# Altium schematic sheet BSPD v2.SchDoc: Brake System Plausibility Device
size 420 x 297 mm; Date: 25/05/23; DrawnBy: Georgios Papandreou; Revision: 2; CarNum: 105; Currentsheet: 1; Totalsheet: 1
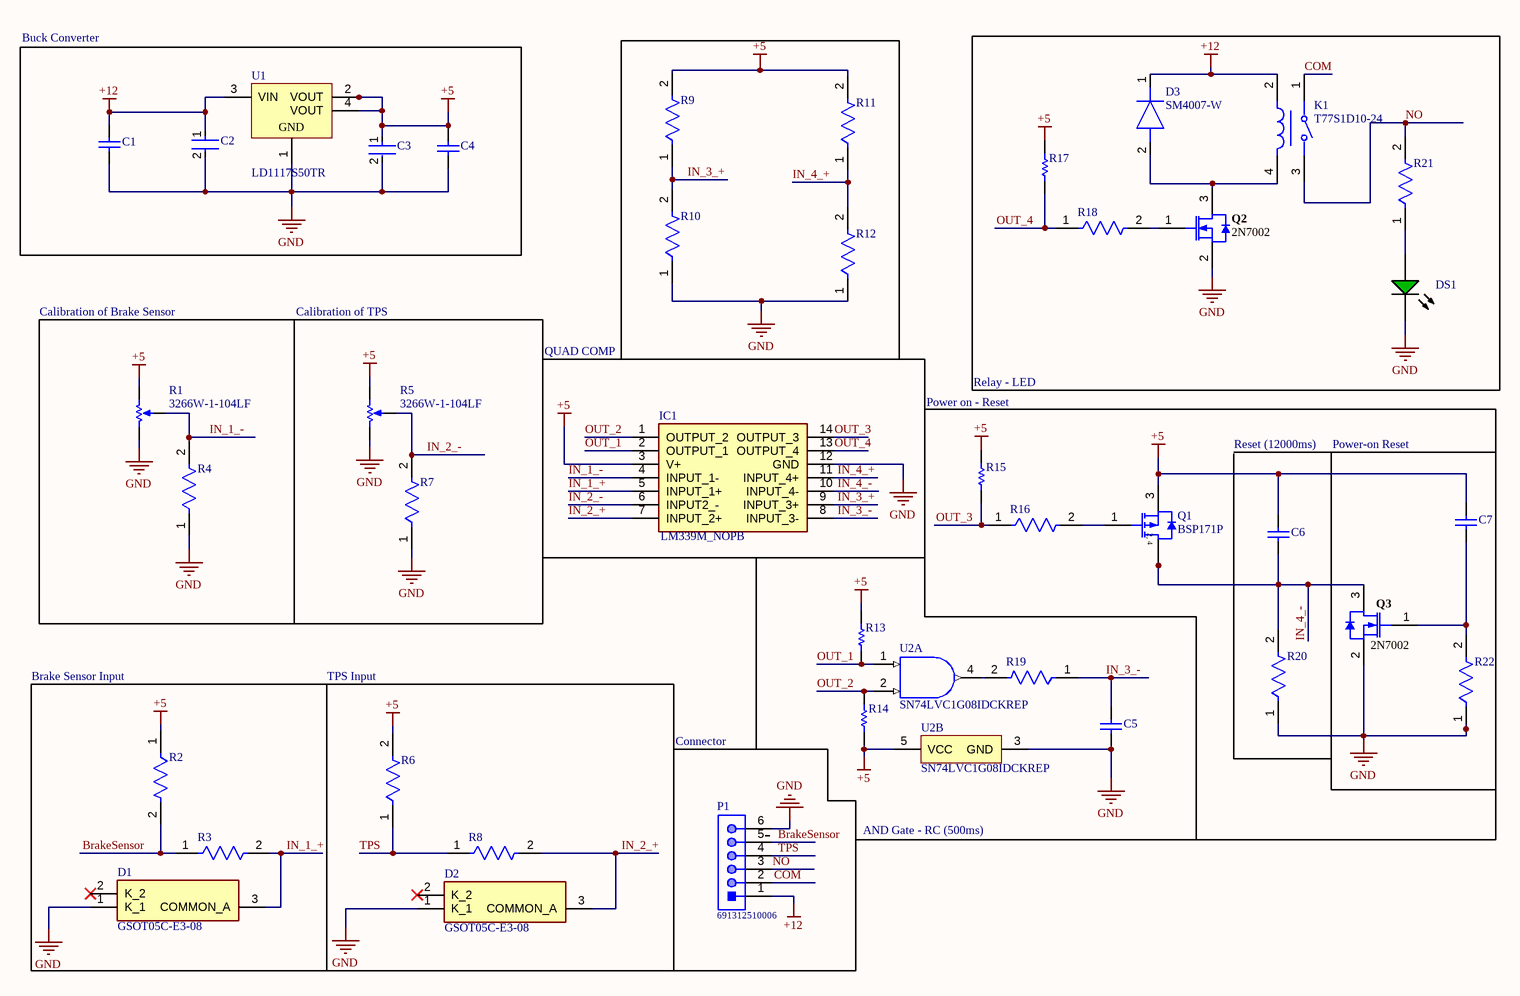
[diagram p0: BSPD v2.SchDoc]

## Parts
C1  C1206C106K8RACTU  [CAPC3216X180X50LL20T25]  (value not drawn)
C2  CL21B104KBCNNNC  [FP-CL21-IPC_C]  (value not drawn)
C3  CL21B104KBCNNNC  [FP-CL21-IPC_C]  (value not drawn)
C4  C1206C106K8RACTU  [CAPC3216X180X50LL20T25]  (value not drawn)
C5  C1206C106K8RACTU  [CAPC3216X180X50LL20T25]  (value not drawn)
C6  C1206C106K8RACTU  [CAPC3216X180X50LL20T25]  (value not drawn)
C7  C1206C106K8RACTU  [CAPC3216X180X50LL20T25]  (value not drawn)
D1  GSOT05C-E3-08  [SOT95P248X115-3N]
D2  GSOT05C-E3-08  [SOT95P248X115-3N]
D3  SM4007-W  [SM4007W]
DS1  LTST-C170KGKT  [LTST-LTST-C170KGKT-2_V]  (value not drawn)
IC1  LM339M_NOPB  [SOIC127P600X175-14N]
K1  T77S1D10-24  [FP-T77S1D10-24-MFG]
P1  691312510006  [691312510006]
Q1  BSP171P  [INF-PG-SOT223_SC-73_N]
Q2  2N7002  [INF-PG-SOT23_M]
Q3  2N7002  [INF-PG-SOT23_M]
R1  3266W-1-104LF  [BOUR-3266W-3_V]
R2  CRCW08052K00FKEA  [FP-CRCW0805-e3-IPC_B]  (value not drawn)
R3  CRCW08052K00FKEA  [FP-CRCW0805-e3-IPC_B]  (value not drawn)
R4  CRCW08052K00FKEA  [FP-CRCW0805-e3-IPC_B]  (value not drawn)
R5  3266W-1-104LF  [BOUR-3266W-3_V]
R6  CRCW08052K00FKEA  [FP-CRCW0805-e3-IPC_B]  (value not drawn)
R7  CRCW08052K00FKEA  [FP-CRCW0805-e3-IPC_B]  (value not drawn)
R8  CRCW08052K00FKEA  [FP-CRCW0805-e3-IPC_B]  (value not drawn)
R9  CRCW08052K00FKEA  [FP-CRCW0805-e3-IPC_B]  (value not drawn)
R10  CRCW08052K00FKEA  [FP-CRCW0805-e3-IPC_B]  (value not drawn)
R11  CRCW08052K00FKEA  [FP-CRCW0805-e3-IPC_B]  (value not drawn)
R12  CRCW08052K00FKEA  [FP-CRCW0805-e3-IPC_B]  (value not drawn)
R13  TNPW08053K00BEEA  [RESC2013X55X40NL15T20]  (value not drawn)
R14  TNPW08053K00BEEA  [RESC2013X55X40NL15T20]  (value not drawn)
R15  TNPW08053K00BEEA  [RESC2013X55X40NL15T20]  (value not drawn)
R16  CRCW08052K00FKEA  [FP-CRCW0805-e3-IPC_B]  (value not drawn)
R17  TNPW08053K00BEEA  [RESC2013X55X40NL15T20]  (value not drawn)
R18  CRCW08052K00FKEA  [FP-CRCW0805-e3-IPC_B]  (value not drawn)
R19  CRCW08052K00FKEA  [FP-CRCW0805-e3-IPC_B]  (value not drawn)
R20  CR0805-JW-125ELF  [FP-CR0805-IPC_A]  (value not drawn)
R21  CRCW08052K00FKEA  [FP-CRCW0805-e3-IPC_B]  (value not drawn)
R22  CRCW08052K00FKEA  [FP-CRCW0805-e3-IPC_B]  (value not drawn)
U1  LD1117S50TR  [SOT-223_L]
U2  SN74LVC1G08IDCKREP  [DCK0005A_L]  (parts A,B of 2)

## Blocks framed on the sheet
Buck Converter: C1-C4 U1
Relay - LED: D3 DS1 K1 Q2 R17 R18 R21
Calibration of Brake Sensor: R1 R4
Reset (12000ms): C6 R20

## Nets
+5: C3.1 C4.2 C6.2 C7.2 IC1.3(V+) Q1.3(SOURCE) R1.1(CCW) R2.1 R5.1(CCW) R6.2 R9.2 R11.2 R13.2 R14.2 R15.2 R17.2 U1.2(VOUT) U1.4(VOUT) U2.5(VCC)
+12: C1.2 C2.1 D3.1(K) K1.2 P1.1 U1.3(VIN)
GND: C1.1 C2.2 C3.2 C4.1 C5.1 D1.1(K_1) D2.1(K_1) DS1.1(K) IC1.12(GND) P1.6 Q2.2(SOURCE) Q3.2(SOURCE) R1.3(CW) R4.1 R5.3(CW) R7.1 R10.1 R12.1 R20.1 R22.1 U1.1(GND) U2.3(GND)
BrakeSensor: P1.5 R2.2 R3.1
COM: K1.1 P1.2
IN_1_+: D1.3(COMMON_A) IC1.5(INPUT_1+) R3.2
IN_1_-: IC1.4(INPUT_1-) R1.2(WIPER) R4.2
IN_2_+: D2.3(COMMON_A) IC1.7(INPUT_2+) R8.2
IN_2_-: IC1.6(INPUT2_-) R5.2(WIPER) R7.2
IN_3_+: IC1.9(INPUT_3+) R9.1 R10.2
IN_3_-: C5.2 IC1.8(INPUT_3-) R19.1
IN_4_+: IC1.11(INPUT_4+) R11.1 R12.2
IN_4_-: C6.1 IC1.10(INPUT_4-) Q1.2(DRAIN) Q1.4(DRAIN) Q3.3(DRAIN) R20.2
NO: K1.3 P1.3 R21.2
OUT_1: IC1.2(OUTPUT_1) R13.1 U2.1(A)
OUT_2: IC1.1(OUTPUT_2) R14.1 U2.2(B)
OUT_3: IC1.14(OUTPUT_3) R15.1 R16.1
OUT_4: IC1.13(OUTPUT_4) R17.1 R18.1
TPS: P1.4 R6.1 R8.1
NetC7_1: C7.1 Q3.1(GATE) R22.2
NetD3_2: D3.2(A) K1.4 Q2.3(DRAIN)
NetDS1_2: DS1.2(A) R21.1
NetQ1_1: Q1.1(GATE) R16.2
NetQ2_1: Q2.1(GATE) R18.2
NetR19_2: R19.2 U2.4(Y)

Not connected (* = marked no-connect by the designer): D1 2(K_2)*; D2 2(K_2)*

## Notes on the sheet
- Calibration of TPS
- QUAD COMP
- (near R15) Power on - Reset
- Power-on Reset
- Brake Sensor Input
- TPS Input
- Connector
- AND Gate - RC (500ms)
- TITLE
- DATE
- DRAWN BY
- CAR NUMBER
- SIZE
- REV
- SHEET
- A3
- /
- (in symbol CMP-1099-00025-1) 2, 4

## Library data of the parts
C1 C4-C6 = CMP-2000-06013-1: Chip Capacitor, 10 uF, +/- 10%, 10 V, -55 to 125 degC, 1206 (3216 Metric), RoHS, Tape and Reel; Type: SMDMLCCX7R6.3-250VDCCommericalGrade; Class: Class1; Case Height: 1.6mm; Temperature Coefficient / Code: +/-15%; Capacitance: 10uF; Brand: Kemet; Case Length: 3.2mm; Dissipation Factor DF: 5; Voltage Rating: 10V; Dielectric: X7R; Tolerance: 10%; Package Reference: 1206; Dimensions: 1.6mmWx3.2mmLx1.6mmH; Series: C1206C; Minimum Operating Temperature: -55C; RoHS: Details; Termination Style: SMD/SMT; Mounting Technology: SurfaceMount; Manufacturer: Kemet; Product Category: MultilayerCeramicCapacitorsMLCC-SMD/SMT; Case Code - mm: 3216; Manufacturer URL: http://www.kemet.com/; Product: GeneralTypeMLCCs; Package Description: 2-Pin Surface Mount Device, Body 3.2 x 1.6 mm; Case Width: 1.6mm; Factory Pack Quantity: 2000; Package / Case: 1206(3216metric); Datasheet URL: http://www.kemet.com/docfinder?Partnumber=C1206C106K8RACTU; Datasheet Version: 02/2016; Operating Temperature Range: -55Cto+125C; Voltage Rating DC: 10V; Case Code - in: 1206; Maximum Operating Temperature: +125C; Packaging: Reel
C2 C3 = CMP-2000-05017-2: CL21 Series 0805 100nF 50V ±10% Tolerance X7R Multilayer Ceramic Chip Capacitor; Depth: 1.25mm; Height: 0.85mm; Width: 0.049inch; Tolerance: 10%; Case Code (Metric): 2012; Case Code (Imperial): 0805; Material: Ceramic; Thickness: 0.037inch; Min Operating Temperature: -55°C; Contact Plating: Tin; Length: 2mm; Mount: Surface Mount; Voltage Rating (DC): 50V; Lead Free: Lead Free; Dielectric: X7R; Radiation Hardening: No; Capacitance: 100nF; Voltage Rating: 50V; Case/Package: 0805; Packaging: Tape and Reel; Max Operating Temperature: 125°C; Voltage: 50V
C7 = CMP-2000-06013-1: Chip Capacitor, 100 nF, +/- 10%, 10 V, -55 to 125 degC, 1206 (3216 Metric), RoHS, Tape and Reel; Type: SMDMLCCX7R6.3-250VDCCommericalGrade; Class: Class1; Case Height: 1.6mm; Temperature Coefficient / Code: +/-15%; Capacitance: 10uF; Brand: Kemet; Case Length: 3.2mm; Dissipation Factor DF: 5; Voltage Rating: 10V; Dielectric: X7R; Tolerance: 10%; Package Reference: 1206; Dimensions: 1.6mmWx3.2mmLx1.6mmH; Series: C1206C; Minimum Operating Temperature: -55C; RoHS: Details; Termination Style: SMD/SMT; Mounting Technology: SurfaceMount; Manufacturer: Kemet; Product Category: MultilayerCeramicCapacitorsMLCC-SMD/SMT; Case Code - mm: 3216; Manufacturer URL: http://www.kemet.com/; Product: GeneralTypeMLCCs; Package Description: 2-Pin Surface Mount Device, Body 3.2 x 1.6 mm; Case Width: 1.6mm; Factory Pack Quantity: 2000; Package / Case: 1206(3216metric); Datasheet URL: http://www.kemet.com/docfinder?Partnumber=C1206C106K8RACTU; Datasheet Version: 02/2016; Operating Temperature Range: -55Cto+125C; Voltage Rating DC: 10V; Case Code - in: 1206; Maximum Operating Temperature: +125C; Packaging: Reel
D1 D2 = GSOT05C-E3-08: Diode ESD (Uni-directional); Manufacturer_Name: Vishay; Datasheet Link: http://www.vishay.com/docs/85824/gsot03c.pdf; Height: 1.15mm; Manufacturer_Part_Number: GSOT05C-E3-08; Mouser Part Number: 78-GSOT05C-E3-08; Mouser Price/Stock: https://www.mouser.co.uk/ProductDetail/Vishay-Semiconductors/GSOT05C-E3-08?qs=S660mHfF5o3O8BVbua%252BuVg%3D%3D; Arrow Part Number: GSOT05C-E3-08; Arrow Price/Stock: https://www.arrow.com/en/products/gsot05c-e3-08/vishay?region=nac
D3 = SM4007-W: Diode; Manufacturer_Name: Rectron; Datasheet Link: https://componentsearchengine.com/Datasheets/1/SM4007-W.pdf; Manufacturer_Part_Number: SM4007-W; Mouser Part Number: 583-SM4007; Mouser Price/Stock: https://www.mouser.co.uk/ProductDetail/Rectron/SM4007-W?qs=Eu63EZxBwKLdRxdF7bUaug%3D%3D; Arrow Part Number: SM4007-W; Arrow Price/Stock: https://www.arrow.com/en/products/sm4007-w/rectron?region=nac
DS1 = CMP-2000-06620-1: Ultra Bright AlInGaP Chip LED, 75 mW, -55 to 85 degC, 2-Pin SMD (0805), RoHS, Tape and Reel; Manufacturer: Lite-On; Forward Current: 30mA; Power Dissipation Max: 75mW; Emitting Color: YellowGreen; Type: Uni-Color; Forward Voltage: 2.4V; Dominant Wave Length: 571nm; Test Current (It): 20mA; Product Length (mm): 2mm; Peak Wavelength: 574nm; Power Dissipation: 75W; Product Depth (mm): 1.25mm; DELETED: Compliant; High Brightness: Yes; Product Height (mm): 1.1mm; Luminous Intensity: 35mcd; Shape Type: Rectangular; Chip Material: AlGaInP; Viewing Angle: 130deg; Number of  Elements: 1; Reverse Voltage: 5V; Rad Hardened: No; Package Type: ChipLed; Manufacturer URL: http://www.us.liteon.com/; Mounting: SurfaceMount; Operating Temp Range: -55Cto85C; Datasheet URL: http://optoelectronics.liteon.com/upload/download/DS22-2000-073/S_110_LTST-C170KGKT.pdf; Packaging: TapeandReel; Pin Count: 2; Package Description: 2-Pin Surface Mounted Device, Body 2 x 1.25 mm; Mounting Technology: SurfaceMount; Package Reference: LTST-C170KGKT-2; Forward Current Max: 30mA; Datasheet Version: Rev. G, 06/2005; Lens Dimensions: 1.4x1.25x0.6mm; Operating Temperature Classification: Industrial; Lum Intensity: 35mcd; Main Category: ChipLED
IC1 = LM339M_NOPB: Integrated Circuit; Manufacturer_Name: Texas Instruments; Manufacturer_Part_Number: LM339M/NOPB; Datasheet Link: https://www.ti.com/general/docs/suppproductinfo.tsp?distId=10&gotoUrl=http%3A%2F%2Fwww.ti.com%2Flit%2Fgpn%2Flm139-n; Height: 1.75mm; Mouser Part Number: 926-LM339M/NOPB; Mouser Price/Stock: https://www.mouser.co.uk/ProductDetail/Texas-Instruments/LM339M-NOPB?qs=X1J7HmVL2ZHXeViUFGsFqA%3D%3D; Arrow Part Number: LM339M/NOPB; Arrow Price/Stock: https://www.arrow.com/en/products/lm339mnopb/texas-instruments
K1 = CMP-03395-000209-1: RELAY GEN PURPOSE SPST 10A 24V; Max Voltage Rating (DC): 30V; Relay Type: General Purpose; Max Voltage Rating (AC): 250V; Coil Power: 500mW; Coil Current: 18.75mA; Operate Time: 10ms; Release Time: 4ms; Approvals: UL; Coil Resistance: 1.28kR; Coil Type: Non-Latching; Mount: Through Hole; RoHS Compliant: Yes; Height: 14.7mm; Current Rating: 10A; Throw Configuration: SPST; Package Quantity: 100; Application(s): GENERAL PURPOSE; Voltage Rating (AC): 250V; Depth: 10.2mm; Min Operating Temperature: -30°C; Length: 0.717inch; Max Operating Temperature: 85°C; Width: 0.4inch; Contact Material: Silver; Packaging: Tray; Termination: PCB; Contact Current Rating: 10A; Number of Pins: 4; Coil Voltage (DC): 24V; Weight: 9g; Series: T77; Radiation Hardening: No; Contact Voltage Rating (DC): 30V
P1 = CMP-1502-02173-1: Serie 312 - 5.08mm Open Horizontal PCB Header WR-TBL, 6 pin; Manufacturer: Wurth Elektronik; Pin Number: 6; Gender: Male; Pitch: 5.08mm; Mounting Technology: THT; Manufacturer URL: http://www.we-online.de; Package Reference: 691312510006; Publisher: WurthElektronik; Packaging: Box; Operating Temperature: -40to105degC; Datasheet URL: http://katalog.we-online.de/em/datasheet/6913125100xx.pdf; Part Number: 691312510006
Q1 = CMP-1099-00025-1: P-Channel SIPMOS Small-Signal-Transistor, -60 V VDS, -1.9 A ID, -55 to 150 degC, PG-SOT223 (SC-73), Reel, Green; Manufacturer: Infineon; Polarity: P; QG: -13Â nC; VGS(th) (min): -1Â V; ID (max): -1.9Â A; RDS (on) (max): 300Â mOhm; VDS (max): -60Â V; Pto t (max): 1.8Â W; VGS(th) (max): -2Â V; Mode: Enhancement; Rth: 110Â K/W; IDpuls (max): -7.6Â A; Green: TRUE; Packing: Reel; DatasheetVersion: Rev. 2.7; ComponentLink3URL: http://www.infineon.com/dgdl/SOT223-Package_Overview.pdf?folderId=db3a30431936bc4b0119530470b03c3d&fileId=db3a30431936bc4b0119531d40b93c5c; Mounting Technology: Surface Mount; Halogen-free: TRUE; PackageVersion: Apr-08; ComponentLink2URL: http://www.infineon.com/dgdl/BSP171P_Rev2.7.pdf?folderId=db3a304314dca38901154a72e3951a65&fileId=db3a30433b47825b013b6004f59a57fa; PackageReference: PG-SOT223 (SC-73); ComponentLink3Description: Package Specification; PackageDescription: 4-Pin Small Outline Transistor Package, 6.5 x 3.5 mm Body, 2.3 mm Pitch; ComponentLink1Description: Manufacturer URL; Technology: SIPMOS; PartNumber: BSP171P; ComponentLink1URL: http://www.infineon.com/; ComponentLink2Description: Datasheet
Q2 Q3 = CMP-1149-00026-1: N-Channel OptiMOS Small-Signal-Transistor, 60 V VDS, 0.3 A ID, -55 to 150 degC, PG-SOT23, Reel, Green; Manufacturer: Infineon; RDS (on) (max) (@4.5V): 4,000 mOhm; VDS (max): 60 V; IDpuls (max): 1.2Â A; QG: 0.4Â nC; RDS (on) (max): 3,000 mOhm; RthJA (max): 250 K/W; ID (max): 0.3Â A; VGS(th) (max): 2.5Â V; VGS(th) (min): 1.5Â V; Green: TRUE; Ptot (max): 0.5Â W; PackageDescription: 3-Pin Small Outline Transistor Package, 2.9 x 1.3 mm Body, 0.95 mm Pitch; Halogen-free: TRUE; ComponentLink2Description: Datasheet; ComponentLink1URL: http://www.infineon.com/; Packing: Reel; DatasheetVersion: Rev. 2.4; PartNumber: 2N7002; PackageReference: PG-SOT23; PackageVersion: Apr-08; ComponentLink3URL: http://www.infineon.com/dgdl/SOT23-Package_Overview.pdf?folderId=db3a30431936bc4b0119532290053c66&fileId=db3a30431936bc4b0119533468123c85; ComponentLink1Description: Manufacturer URL; Mounting Technology: Surface Mount; ComponentLink3Description: Package Specification; ComponentLink2URL: http://www.infineon.com/dgdl/2N7002_Rev2.4.pdf?folderId=db3a3043156fd573011622e10b5c1f67&fileId=db3a304319bc939a0119c2a9461e79e6
R1 R5 = CMP-0975-00021-1: Square Trimpot Trimming Potentiometer, 100 KOhm, 0.25 W, -55 to 125 degC, 3-Pin THD, RoHS, Tube; Manufacturer: Bourns; Power Rating@70 degC: 0.25 W; Tolerance: +/-10%; ComponentLink2URL: https://www.bourns.com/data/global/pdfs/3266.pdf; ComponentLink3Description: Package Specification; ComponentLink1URL: https://www.bourns.com/; ComponentLink2Description: Datasheet; DatasheetVersion: Apr-14; ComponentLink3URL: https://www.bourns.com/data/global/pdfs/3266.pdf; Mounting Technology: Through Hole; Packing: Tube; PackageDescription: 3-Pin THD, Body 6.35 x 4.31 mm, Pitch 2.54 mm; ComponentLink1Description: Manufacturer URL; Operating Temperature: -55 to 125 degC; PartNumber: 3266W-1-104LF; Resistance: 100 kOhm; RoHS: TRUE
R2 R6 R10 = CMP-2001-03755-2: RES Thick Film, 100kΩ, 1%, 0.125W, 100ppm/°C, 0805; Working Voltage: 150V; Max Power Dissipation: 125mW; Resistance: 2kR; Package Quantity: 10; Case Code (Metric): 2012; Voltage Rating: 150V; Number of Terminations: 2; Max Operating Temperature: 155°C; Depth: 1.25mm; Tolerance: 1%; Power Rating: 125mW; Lead Free: Lead Free; Case/Package: 0805; Features: Automotive AEC-Q200; Min Operating Temperature: -55°C; Termination: SMD/SMT; Case Code (Imperial): 0805; Weight: 0.000194oz; Packaging: Tape and Reel; Military Standard: Not; Radiation Hardening: No; Contact Plating: Tin; Mount: Surface Mount; Temperature Coefficient: 100ppm/°C; Height: 0.02inch; Number of Terminals: 2; Voltage Rating (DC): 150V; Number of Pins: 2; Length: 2mm; Width: 1.25mm; Composition: Thick Film
R3 R4 R7 R8 R12 = CMP-2001-03755-2: RES Thick Film, 10kΩ, 1%, 0.125W, 100ppm/°C, 0805; Working Voltage: 150V; Max Power Dissipation: 125mW; Resistance: 2kR; Package Quantity: 10; Case Code (Metric): 2012; Voltage Rating: 150V; Number of Terminations: 2; Max Operating Temperature: 155°C; Depth: 1.25mm; Tolerance: 1%; Power Rating: 125mW; Lead Free: Lead Free; Case/Package: 0805; Features: Automotive AEC-Q200; Min Operating Temperature: -55°C; Termination: SMD/SMT; Case Code (Imperial): 0805; Weight: 0.000194oz; Packaging: Tape and Reel; Military Standard: Not; Radiation Hardening: No; Contact Plating: Tin; Mount: Surface Mount; Temperature Coefficient: 100ppm/°C; Height: 0.02inch; Number of Terminals: 2; Voltage Rating (DC): 150V; Number of Pins: 2; Length: 2mm; Width: 1.25mm; Composition: Thick Film
R9 R11 R19 = CMP-2001-03755-2: RES Thick Film, 39kΩ, 1%, 0.125W, 100ppm/°C, 0805; Working Voltage: 150V; Max Power Dissipation: 125mW; Resistance: 2kR; Package Quantity: 10; Case Code (Metric): 2012; Voltage Rating: 150V; Number of Terminations: 2; Max Operating Temperature: 155°C; Depth: 1.25mm; Tolerance: 1%; Power Rating: 125mW; Lead Free: Lead Free; Case/Package: 0805; Features: Automotive AEC-Q200; Min Operating Temperature: -55°C; Termination: SMD/SMT; Case Code (Imperial): 0805; Weight: 0.000194oz; Packaging: Tape and Reel; Military Standard: Not; Radiation Hardening: No; Contact Plating: Tin; Mount: Surface Mount; Temperature Coefficient: 100ppm/°C; Height: 0.02inch; Number of Terminals: 2; Voltage Rating (DC): 150V; Number of Pins: 2; Length: 2mm; Width: 1.25mm; Composition: Thick Film
R13-R15 R17 = CMP-2001-04767-1: Manufacturer: Vishay Dale; Part Number: TNPW08053K00BEEA
R16 R18 = CMP-2001-03755-2: RES Thick Film, 100Ω, 1%, 0.125W, 100ppm/°C, 0805; Working Voltage: 150V; Max Power Dissipation: 125mW; Resistance: 2kR; Package Quantity: 10; Case Code (Metric): 2012; Voltage Rating: 150V; Number of Terminations: 2; Max Operating Temperature: 155°C; Depth: 1.25mm; Tolerance: 1%; Power Rating: 125mW; Lead Free: Lead Free; Case/Package: 0805; Features: Automotive AEC-Q200; Min Operating Temperature: -55°C; Termination: SMD/SMT; Case Code (Imperial): 0805; Weight: 0.000194oz; Packaging: Tape and Reel; Military Standard: Not; Radiation Hardening: No; Contact Plating: Tin; Mount: Surface Mount; Temperature Coefficient: 100ppm/°C; Height: 0.02inch; Number of Terminals: 2; Voltage Rating (DC): 150V; Number of Pins: 2; Length: 2mm; Width: 1.25mm; Composition: Thick Film
R20 = CMP-1013-00148-2: Thick Film Chip Resistors 0805 1.2MΩ 0.125W 5% 200ppm/°C; Power Rating: 125mW; Resistance: 1.2MR; Voltage Rating: 150V; Features: Moisture Resistant; Radiation Hardening: No; Max Power Dissipation: 125mW; Packaging: Tape and Reel; Military Standard: Not; Temperature Coefficient: 200ppm/°C; Contact Plating: Tin; Depth: 1.25mm; Height: 0.024inch; Case Code (Imperial): 0805; Termination: SMD/SMT; Thickness: 508um; Width: 1.25mm; Max Operating Temperature: 155°C; Case/Package: 0805; Mount: Surface Mount; Case Code (Metric): 2012; Package Quantity: 5000; Tolerance: 5%; Length: 2mm; Composition: Thick Film; Min Operating Temperature: -55°C; Number of Terminations: 2
R21 = CMP-2001-03755-2: RES Thick Film, 360Ω, 1%, 0.125W, 100ppm/°C, 0805; Working Voltage: 150V; Max Power Dissipation: 125mW; Resistance: 2kR; Package Quantity: 10; Case Code (Metric): 2012; Voltage Rating: 150V; Number of Terminations: 2; Max Operating Temperature: 155°C; Depth: 1.25mm; Tolerance: 1%; Power Rating: 125mW; Lead Free: Lead Free; Case/Package: 0805; Features: Automotive AEC-Q200; Min Operating Temperature: -55°C; Termination: SMD/SMT; Case Code (Imperial): 0805; Weight: 0.000194oz; Packaging: Tape and Reel; Military Standard: Not; Radiation Hardening: No; Contact Plating: Tin; Mount: Surface Mount; Temperature Coefficient: 100ppm/°C; Height: 0.02inch; Number of Terminals: 2; Voltage Rating (DC): 150V; Number of Pins: 2; Length: 2mm; Width: 1.25mm; Composition: Thick Film
R22 = CMP-2001-03755-2: RES Thick Film, 560kΩ, 1%, 0.125W, 100ppm/°C, 0805; Working Voltage: 150V; Max Power Dissipation: 125mW; Resistance: 2kR; Package Quantity: 10; Case Code (Metric): 2012; Voltage Rating: 150V; Number of Terminations: 2; Max Operating Temperature: 155°C; Depth: 1.25mm; Tolerance: 1%; Power Rating: 125mW; Lead Free: Lead Free; Case/Package: 0805; Features: Automotive AEC-Q200; Min Operating Temperature: -55°C; Termination: SMD/SMT; Case Code (Imperial): 0805; Weight: 0.000194oz; Packaging: Tape and Reel; Military Standard: Not; Radiation Hardening: No; Contact Plating: Tin; Mount: Surface Mount; Temperature Coefficient: 100ppm/°C; Height: 0.02inch; Number of Terminals: 2; Voltage Rating (DC): 150V; Number of Pins: 2; Length: 2mm; Width: 1.25mm; Composition: Thick Film
U1 = CMP-0244-00312-1: Fixed Low Drop Positive Voltage Regulator, 5V, 4-Pin SOT-223, Tape and Reel; ComponentLink1URL: http://www.st.com; DatasheetVersion: 1/11/2011; PackageDescription: 4-Pin SOT-223 Package, 6.5 x 3.5 mm Body, 2.3 mm Pitch, 7 mm Lead Span; ComponentLink2URL: http://www.st.com/internet/com/TECHNICAL_RESOURCES/TECHNICAL_LITERATURE/DATASHEET/CD00000544.pdf; ComponentLink1Description: Manufacturer URL; PackageReference: SOT-223; PackageVersion: 2010; ComponentLink2Description: Datasheet
U2 = CMP-0859-00273-3: Enhanced Product Single 2-Input Positive-And Gate, DCK0005A, LARGE T&R; Generic Part Number: SN74LVC1G08-EP; Manufacturer: Texas Instruments; Output Drive (IOL/IOH)(Max)(mA): 32/-32; Schmitt Trigger: No; Bits(#): 1; ICC @ Nom Voltage(Max)(mA): 0.01; Voltage(Nom)(V): 1.8,2.5,3.3,5; VCC(Min)(V): 1.65; VCC(Max)(V): 5.5; Output Type: CMOS; Logic: True; Rating: HiRel Enhanced Product; F @ Nom Voltage(Max)(Mhz): 150; tpd @ Nom Voltage(Max)(ns): 8,5.5,4.5,4; Gate Type: AND; Input Type: CMOS/TTL; Technology Family: LVC; 3-State Output: No; Sub-Family: AND Gate; PackageReference: DCK0005A; DatasheetVersion: SCES454C; Operating Temperature Range(C): -40 to 85,-55 to 125